# Altium schematic sheet GPS.SchDoc
size B; SheetNumber: 2; SheetTotal: 8
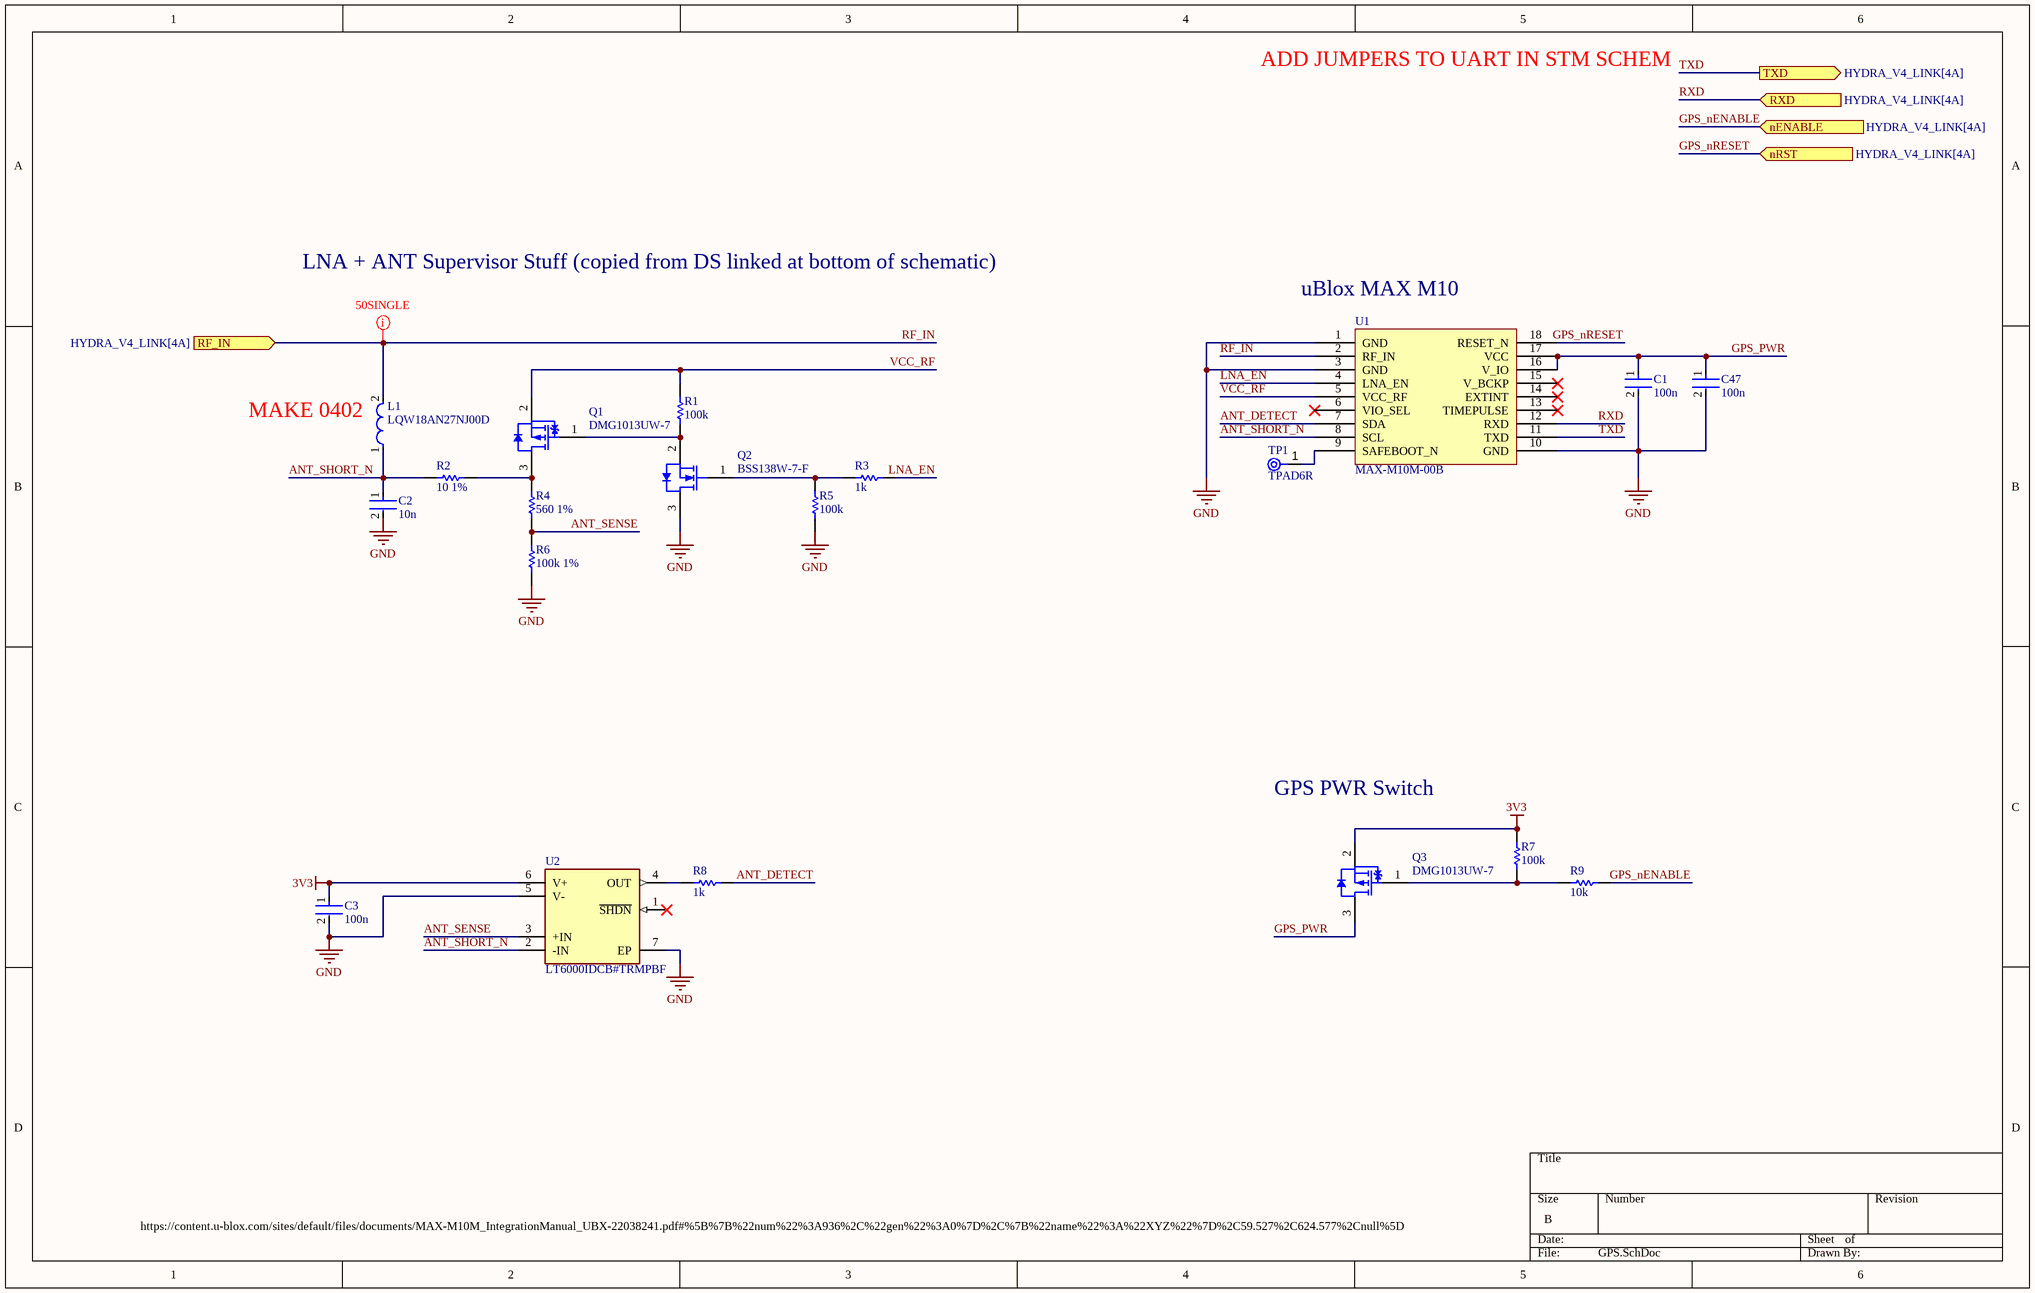
[diagram p0: GPS.SchDoc]

## Parts
C1  100n  [FP-0402-L_1_0_0_05-W_0_5-IPC_A]
C2  10n  [FP-0402-L_1_0_0_05-W_0_5-IPC_A]
C3  100n  [FP-0402-L_1_0_0_05-W_0_5-IPC_A]
C47  100n  [FP-0402-L_1_0_0_05-W_0_5-IPC_A]
L1  LQW18AN27NJ00D  [FP-LQW18AN_00-MFG]
Q1  DMG1013UW-7  [DIOD-SOT323-3_V]
Q2  BSS138W-7-F  [DIOD-SOT323-3_V]
Q3  DMG1013UW-7  [DIOD-SOT323-3_V]
R1  100k  [R0603B]
R2  10 1%  [R0603B]
R3  1k  [R0603B]
R4  560 1%  [R0603B]
R5  100k  [R0603B]
R6  100k 1%  [R0603B]
R7  100k  [R0603B]
R8  1k  [R0603B]
R9  10k  [R0603B]
TP1  TPAD6R  [New footprint 1]
U1  MAX-M10M-00B  [MAX-M10M-00B-Footprint-1]
U2  LT6000IDCB#TRMPBF  [FP-DCB-6-05-08-1715-MFG]

## Ports
nENABLE (in, see HYDRA_V4_LINK[4A]), nRST (in, see HYDRA_V4_LINK[4A]), RF_IN (in, see HYDRA_V4_LINK[4A]), RXD (in, see HYDRA_V4_LINK[4A]), TXD (out, see HYDRA_V4_LINK[4A])

## Nets
3V3: C3.1 Q3.2(S) R7.2 U2.6(V+)
GND: C1.2 C2.2 C3.2 C47.2 Q2.3(D) R5.2 R6.2 U1.1(GND) U1.3(GND) U1.10(GND) U2.5(V-) U2.7(EP)
ANT_DETECT: R8.1 U1.7(SDA)
ANT_SENSE: R4.2 R6.1 U2.3(+IN)
ANT_SHORT_N: C2.1 L1.1 R2.2 U1.8(SCL) U2.2(-IN)
GPS_nENABLE: R9.1 ; port nENABLE
GPS_nRESET: U1.18(RESET_N) ; port nRST
GPS_PWR: C1.1 C47.1 Q3.3(D) U1.16(V_IO) U1.17(VCC)
LNA_EN: R3.1 U1.4(LNA_EN)
RF_IN: L1.2 U1.2(RF_IN) ; port RF_IN
RXD: U1.12(RXD) ; port RXD
TXD: U1.11(TXD) ; port TXD
VCC_RF: Q1.2(S) R1.1 U1.5(VCC_RF)
NetQ1_1: Q1.1(G) Q2.2(S) R1.2
NetQ1_3: Q1.3(D) R2.1 R4.1
NetQ2_1: Q2.1(G) R3.2 R5.1
NetQ3_1: Q3.1(G) R7.1 R9.2
NetR8_2: R8.2 U2.4(OUT)
NetTP1_1: TP1.1(TP) U1.9(SAFEBOOT_N)

Not connected (* = marked no-connect by the designer): U1 6(VIO_SEL)* 13(TIMEPULSE)* 14(EXTINT)* 15(V_BCKP)*; U2 1(~{SHDN})*

## Layout directives
net class 50SINGLE: RF_IN

## Notes on the sheet
- ADD JUMPERS TO UART IN STM SCHEM
- LNA + ANT Supervisor Stuff (copied from DS linked at bottom of schematic)
- (near U1) uBlox MAX M10
- (near L1) MAKE 0402
- GPS PWR Switch
- https://content.u-blox.com/sites/default/files/documents/MAX-M10M_IntegrationManual_UBX-22038241.pdf#%5B%7B%22num%22%3A936%2C%22gen%22%3A0%7D%2C%7B%22name%22%3A%22XYZ%22%7D%2C59.527%2C624.577%2Cnull%5D

## Library data of the parts
C1-C3 C47 = CMP-001-00058-1: LARGE PADS, 0402 CAP, CHANGE COMMENT TO MATCH REAL P/N; Capacitor Type: Ceramic; Min Operating Temperature: -55°C; Mounting Technology: Surface Mount; Pins: 2; Case/Package: 0402; RoHS Compliant: Yes; Max Operating Temperature: 85°C
L1 = CMP-06042-013840-1: Wire Wound RF Inductor 27nH ±5% 440mA 0.21Ω 0603 (1608); Shielding: Unshielded; Test Frequency: 100MHz; Q Factor: 40; Self Resonant Frequency: 3.7GHz; DC Resistance (DCR): 210mR; Core Material: Non-Magnetic; Depth: 1mm; Min Operating Temperature: -55°C; Package Quantity: 4000; Inductance: 27nH; Case Code (Metric): 1608; Height - Seated (Max): 0.039inch; Resistor Type: Wirewound; Max DC Current: 440mA; Tolerance: 5%; Length: 1.6mm; Mount: Surface Mount; DC Current: 440mA; Packaging: Tape and Reel; Lead Free: Lead Free; Case Code (Imperial): 0603; Current Rating: 440mA; Width: 0.8mm; Max Operating Temperature: 125°C; Termination: SMD/SMT; Weight: 0.000106oz; Radiation Hardening: No; Height: 0.8mm; Case/Package: 0603; Military Standard: Not
Q1 Q3 = CMP-2000-06170-1: P-Channel Enhancement Mode MOSFET, 310 mW, 20 V, -55 to 150 degC, 3-Pin SOT-323, RoHS, Tape and Reel; Manufacturer: Diodes Inc; Qg Gate Charge: 0.622nC; Drain-Source On Resistance-Max: 750mO; Rated Power Dissipation: 310mW; Drain-to-Source Voltage [Vdss]: 20V; Package Reference: SOT323; Datasheet Version: Rev. 3-2, 09/2013; Package Description: 3-Pin Small Outline Transistor, Body 2 x 1.25 mm, Pitch 0.65 mm; Mounting Technology: SurfaceMount; Manufacturer URL: http://www.diodes.com/; Datasheet URL: http://www.diodes.com/_files/datasheets/ds31861.pdf; Channel Type: P-Channel
Q2 = CMP-2000-05968-1: N-Channel Enhancement Mode Mosfet, 50 V, 200 mA, -55 to 150 degC, 6-Pin SOT-323, RoHS, Tape and Reel; Typical Turn-Off Delay Time: 20ns; Number of Channels: 1Channel; Type: EnhancementModeFieldEffectTransistor; Brand: DiodesIncorporated; Vds - Drain-Source Breakdown Voltage: 75V; Vgs - Gate-Source Voltage: 20V; Rds On - Drain-Source Resistance: 1.4Ohms; Transistor Type: 1N-Channel; Configuration: Single; Unit Weight: 0.000212oz; Pd - Power Dissipation: 200mW; Id - Continuous Drain Current: 200mA; Forward Transconductance - Min: 0.1S; Manufacturer URL: http://www.diodes.com/; Series: BSS138; Package Description: 3-Pin Small Outline Transistor, Body 2 x 1.25 mm, Pitch 0.65 mm; Mounting Technology: SurfaceMount; Product Category: MOSFET; RoHS: True; Maximum Operating Temperature: +150C; Height: 1mm; Length: 2.2mm; Technology: Si; Width: 1.35mm; Datasheet URL: http://www.diodes.com/_files/datasheets/ds30206.pdf; Manufacturer: DiodesIncorporated; Package / Case: SOT-323-3; Typical Turn-On Delay Time: 20ns; Transistor Polarity: N-Channel; Factory Pack Quantity: 3000; Packaging: Reel; Product: MOSFETSmallSignal; Datasheet Version: Rev. 11-2, 09/2013; Package Reference: SOT323; Minimum Operating Temperature: -55C; Mounting Style: SMD/SMT; Channel Mode: Enhancement
R1-R9 = CMP-009-00002-14: Resistor
TP1 = CMP-00025-2: Test Point .6mm
U1 = CMP-010-00031-1: Gnss Lcc Rx Mod, Rom, Crystal
U2 = CMP-09116-000039-1: IC OPAMP GP 1 CIRCUIT 6DFN; Number of Elements: 1; Power Supply Rejection Ratio (PSRR): 86dB; Output Current per Channel: 10mA; Gain Bandwidth Product: 60kHz; Operating Supply Current: 20uA; Input Bias Current: 12nA; Voltage Gain: 120dB; Max Supply Voltage: 18V; Input Offset Voltage (Vos): 1.2mV; Min Supply Voltage: 1.8V; Slew Rate: 0.018V/µs; Common Mode Rejection Ratio: 68dB; Packaging: Tape and Reel; Mount: Surface Mount; Case/Package: DFN; Max Operating Temperature: 85°C; Number of Pins: 6; Number of Amplifiers: 1; REACH SVHC: No SVHC; Unity Gain Bandwidth Product: 60kHz; Bandwidth: 60kHz; Lead Free: Lead Free; Number of Circuits: 1; Min Operating Temperature: -40°C; Package Quantity: 1